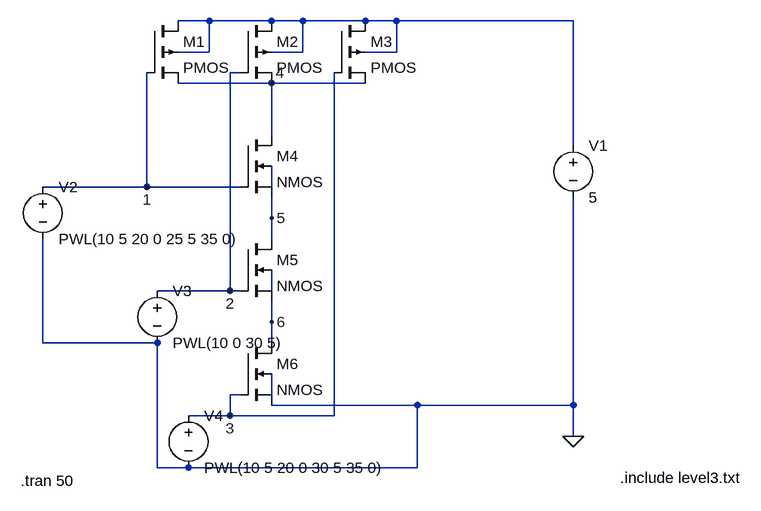
[diagram p0: schematic Draft1.asc]
Draft1.asc, the LTspice schematic file:
Version 4
SHEET 1 1032 788
WIRE 192 64 144 64
WIRE 288 64 192 64
WIRE 336 64 288 64
WIRE 432 64 336 64
WIRE 480 64 432 64
WIRE 752 64 480 64
WIRE 192 112 192 64
WIRE 192 112 144 112
WIRE 336 112 336 64
WIRE 336 112 288 112
WIRE 480 112 480 64
WIRE 480 112 432 112
WIRE 240 144 224 144
WIRE 288 160 144 160
WIRE 432 160 288 160
WIRE 288 240 288 160
WIRE 752 256 752 64
WIRE 96 320 96 144
WIRE 96 320 -64 320
WIRE 240 320 96 320
WIRE 288 320 288 288
WIRE 288 368 288 336
WIRE 288 400 288 368
WIRE 224 480 224 144
WIRE 224 480 112 480
WIRE 240 480 224 480
WIRE 288 480 288 448
WIRE 288 528 288 496
WIRE -64 560 -64 400
WIRE 112 560 -64 560
WIRE 288 560 288 528
WIRE 240 640 224 640
WIRE 288 640 288 608
WIRE 512 656 288 656
WIRE 752 656 752 336
WIRE 752 656 512 656
WIRE 224 672 224 640
WIRE 224 672 160 672
WIRE 384 672 384 144
WIRE 384 672 224 672
WIRE 752 704 752 656
WIRE 112 752 112 560
WIRE 160 752 112 752
WIRE 512 752 512 656
WIRE 512 752 160 752
FLAG 752 704 0
FLAG 96 320 1
FLAG 224 480 2
FLAG 224 672 3
FLAG 288 160 4
FLAG 288 368 5
FLAG 288 528 6
SYMBOL pmos4 96 64 R0
SYMATTR InstName M1
SYMBOL pmos4 240 64 R0
SYMATTR InstName M2
SYMBOL pmos4 384 64 R0
SYMATTR InstName M3
SYMBOL nmos4 240 240 R0
SYMATTR InstName M4
SYMBOL nmos4 240 400 R0
SYMATTR InstName M5
SYMBOL nmos4 240 560 R0
SYMATTR InstName M6
SYMBOL voltage 752 240 R0
WINDOW 123 0 0 Left 0
WINDOW 39 0 0 Left 0
SYMATTR InstName V1
SYMATTR Value 5
SYMBOL voltage -64 304 R0
WINDOW 123 0 0 Left 0
WINDOW 39 0 0 Left 0
SYMATTR InstName V2
SYMATTR Value PWL(10 5 20 0 25 5 35 0)
SYMBOL voltage 112 464 R0
WINDOW 123 0 0 Left 0
WINDOW 39 0 0 Left 0
SYMATTR InstName V3
SYMATTR Value PWL(10 0 30 5)
SYMBOL voltage 160 656 R0
WINDOW 123 0 0 Left 0
WINDOW 39 0 0 Left 0
SYMATTR InstName V4
SYMATTR Value PWL(10 5 20 0 30 5 35 0)
TEXT -98 772 Left 2 !.tran 50
TEXT 824 768 Left 2 !.include level3.txt

The netlist it stands for:
* Draft1.asc
M1 N001 1 4 N001 PMOS
M2 N001 2 4 N001 PMOS
M3 N001 3 4 N001 PMOS
M4 4 1 5 N002 NMOS
M5 5 2 6 N003 NMOS
M6 6 3 0 N004 NMOS
V1 N001 0 5
V2 1 0 PWL(10 5 20 0 25 5 35 0)
V3 2 0 PWL(10 0 30 5)
V4 3 0 PWL(10 5 20 0 30 5 35 0)
.model NMOS NMOS
.model PMOS PMOS
.lib standard.mos
.tran 50
.include level3.txt
.backanno
.end